# Altium schematic sheet LORA.SchDoc: EByte LoRa Module
size 420 x 297 mm; SheetNumber: 3
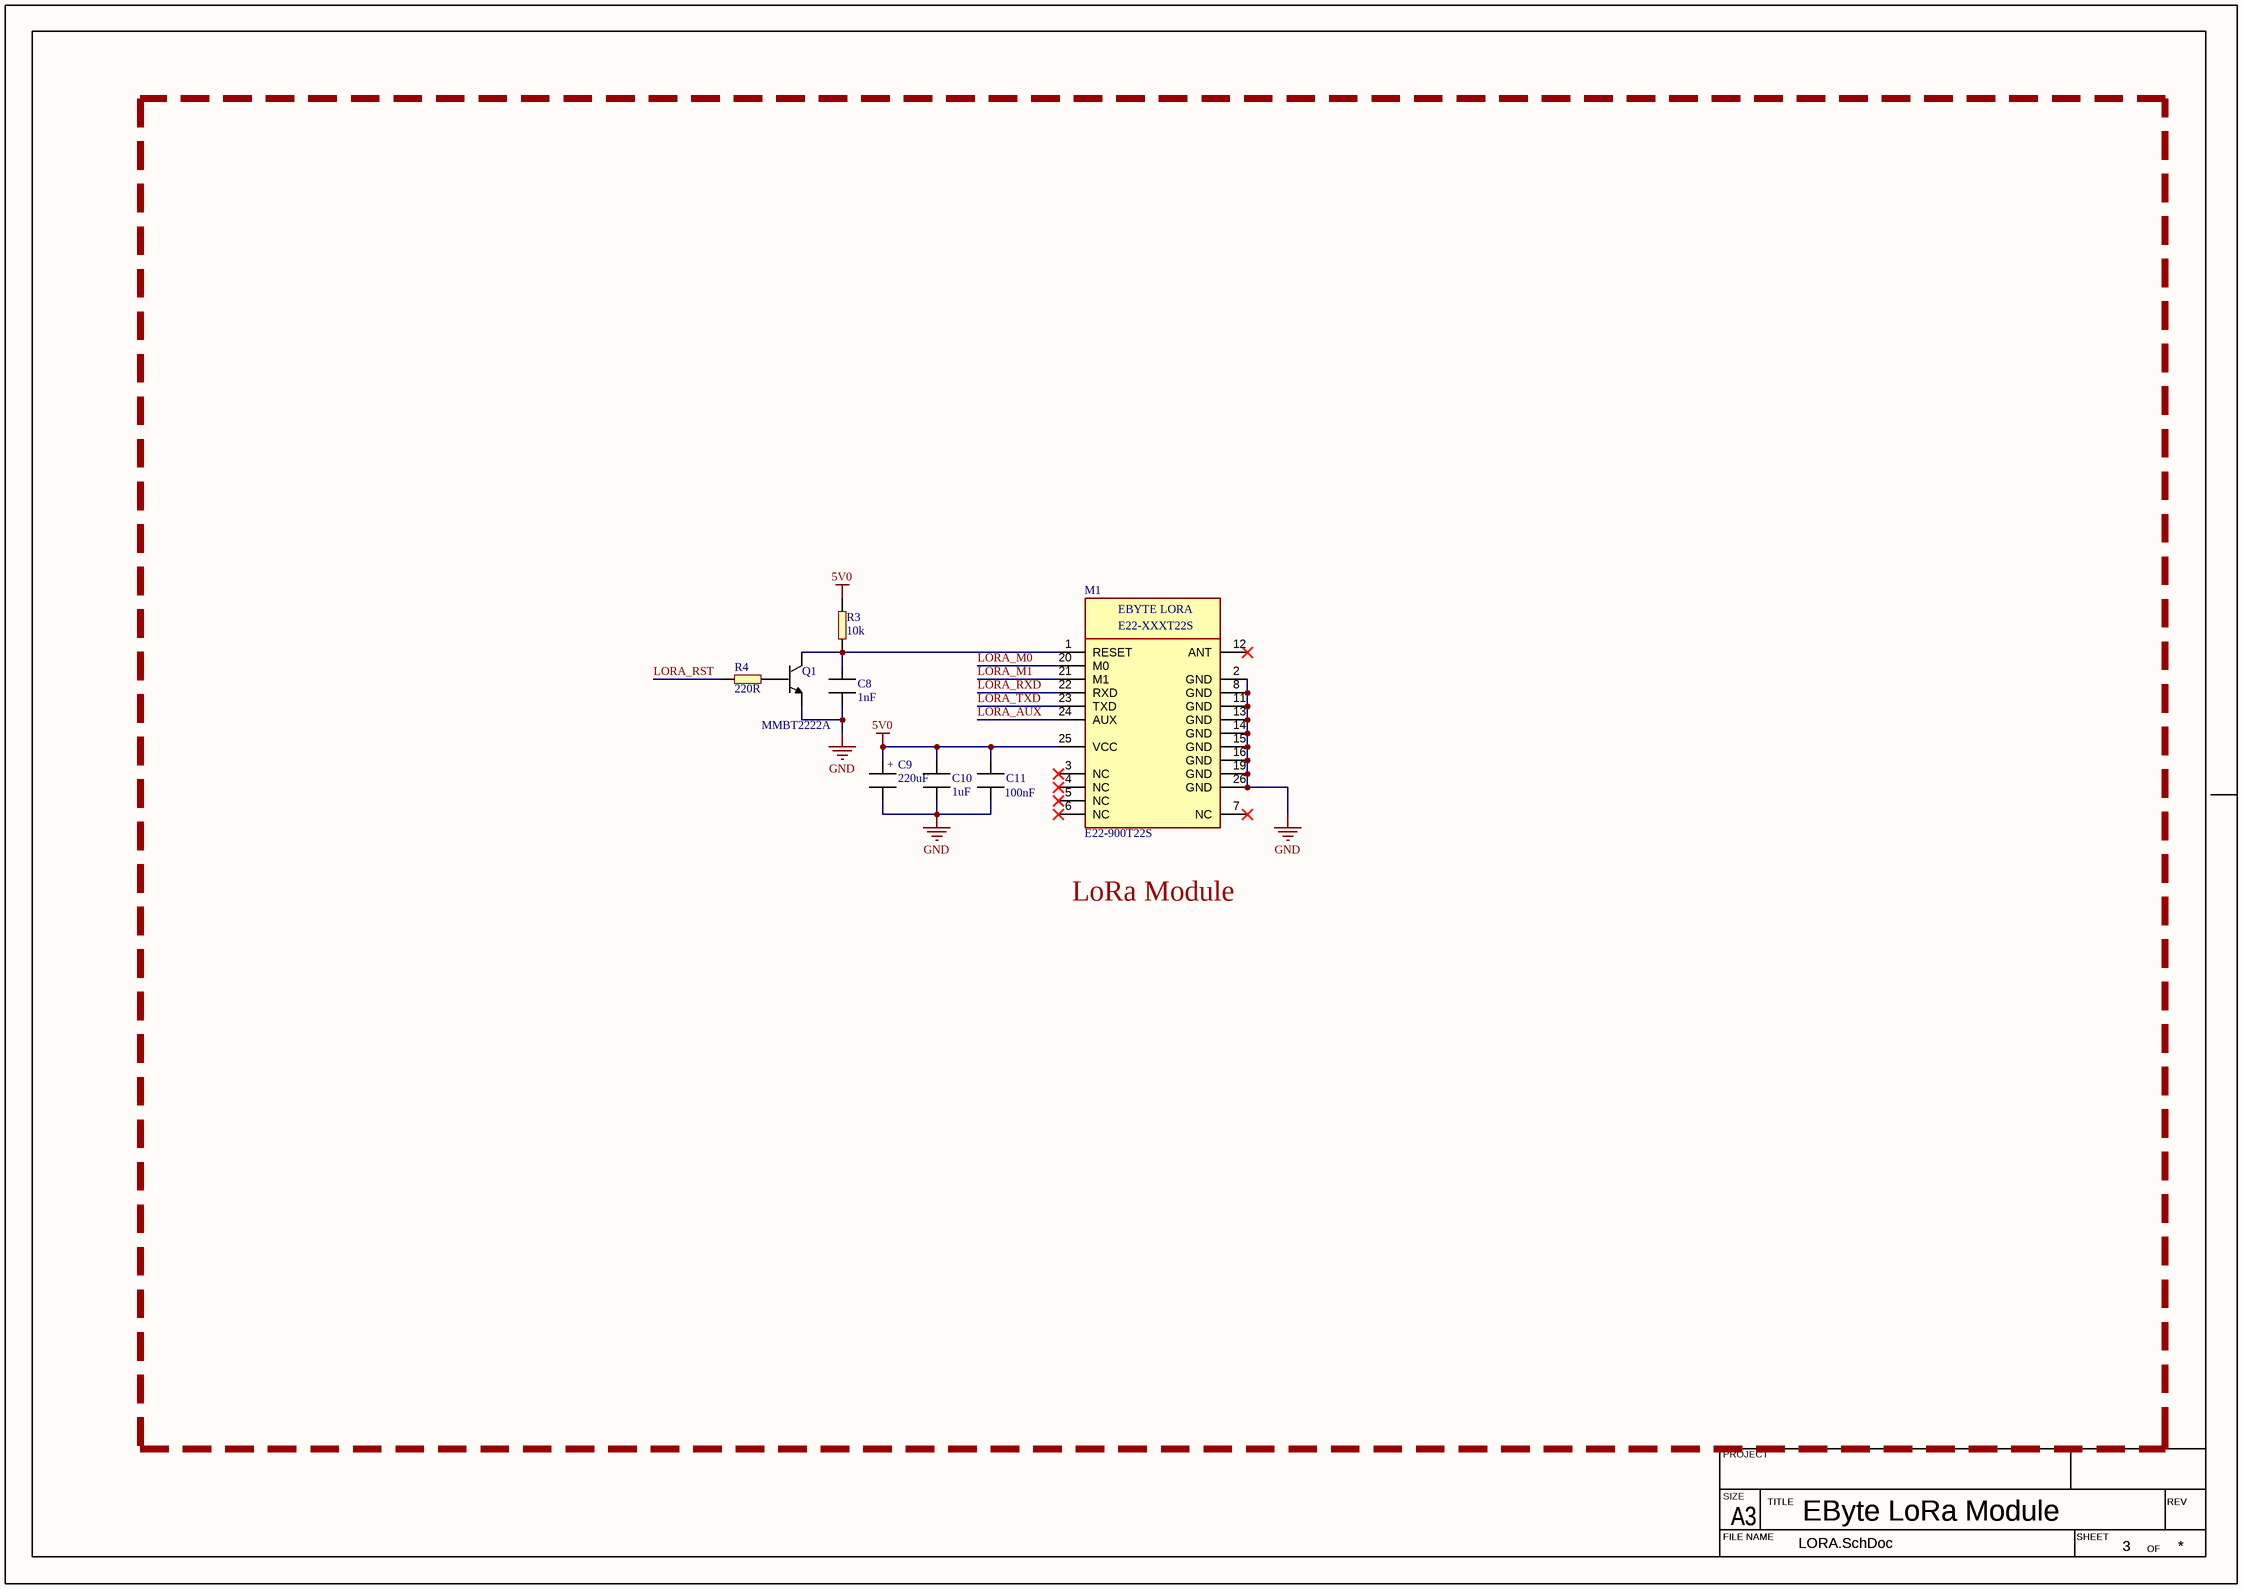
[diagram p0: LORA.SchDoc]

## Parts
C8  value 1nF  [CAPC2012X13L]  (hidden comment: MLCC_0805)  (no BOM)
C9  value 220uF  [CAP_D10_H16_P5 - Flat]  (hidden comment: ERP_102-2)
C10  value 1uF  [CAPC2012X13L]  (hidden comment: MLCC_0805)
C11  value 100nF  [CAPC2012X13L]  (hidden comment: MLCC_0805)
M1  value E22-900T22S  [E22-XXXT22S]  (hidden comment: E22-XXXT22S)
Q1  value MMBT2222A  [MMBT2222]  (hidden comment: ERP_105-1)
R3  value 10k  [RES_0603]  (hidden comment: ERP_101-1)
R4  value 220R  [RES_0603]  (hidden comment: ERP_101-1)

## Nets
5V0: C9.1 C10.1 C11.1 M1.25(VCC) R3.2
GND: C8.2 C9.2 C10.2 C11.2 M1.2(GND) M1.8(GND) M1.11(GND) M1.13(GND) M1.14(GND) M1.15(GND) M1.16(GND) M1.19(GND) M1.26(GND) Q1.2
LORA_AUX: M1.24(AUX)
LORA_M0: M1.20(M0)
LORA_M1: M1.21(M1)
LORA_RST: R4.2
LORA_RXD: M1.22(RXD)
LORA_TXD: M1.23(TXD)
NetC8_1: C8.1 M1.1(RESET) Q1.3 R3.1
NetQ1_1: Q1.1 R4.1

Not connected (* = marked no-connect by the designer): M1 3(NC)* 4(NC)* 5(NC)* 6(NC)* 7(NC)* 12(ANT)*

## Notes on the sheet
- LoRa Module
- PROJECT
- SIZE
- FILE NAME
- A3
- TITLE
- SHEET
- OF
- REV
- (in symbol CAP_D10_H16_P5) +
- (in symbol E22-XXXT22S) EBYTE LORA

## Library data of the parts
C8 C10 C11 = MLCC_0805: Chip Capacitor, 2-Leads, Body 2.00x1.25mm, IPC High Density; Package: 0805; Manufacturer 1: *; Manufacturer Part Number 1: *
C9 = CAP_D10_H16_P5: Electrolytic Capacitor Through Hole D10 P5.0; Package: 10X5; Manufacturer 1: *; Manufacturer Part Number 1: *; Supplier 1: *
M1 = E22-XXXT22S: E22 EByte LoRa Module; Manufacturer 1: *; Manufacturer Part Number 1: *
Q1 = MMBT2222: MMBT2222A; ERP: *; Suuplier Part Number 1: *; Supplier 1: *; Manufacturer Part Number 1: *; Manufacturer 1: *; Package: SOT23
R3 R4 = RES_0603: Package: 0603; Manufacturer 1: *; Manufacturer Part Number 1: *